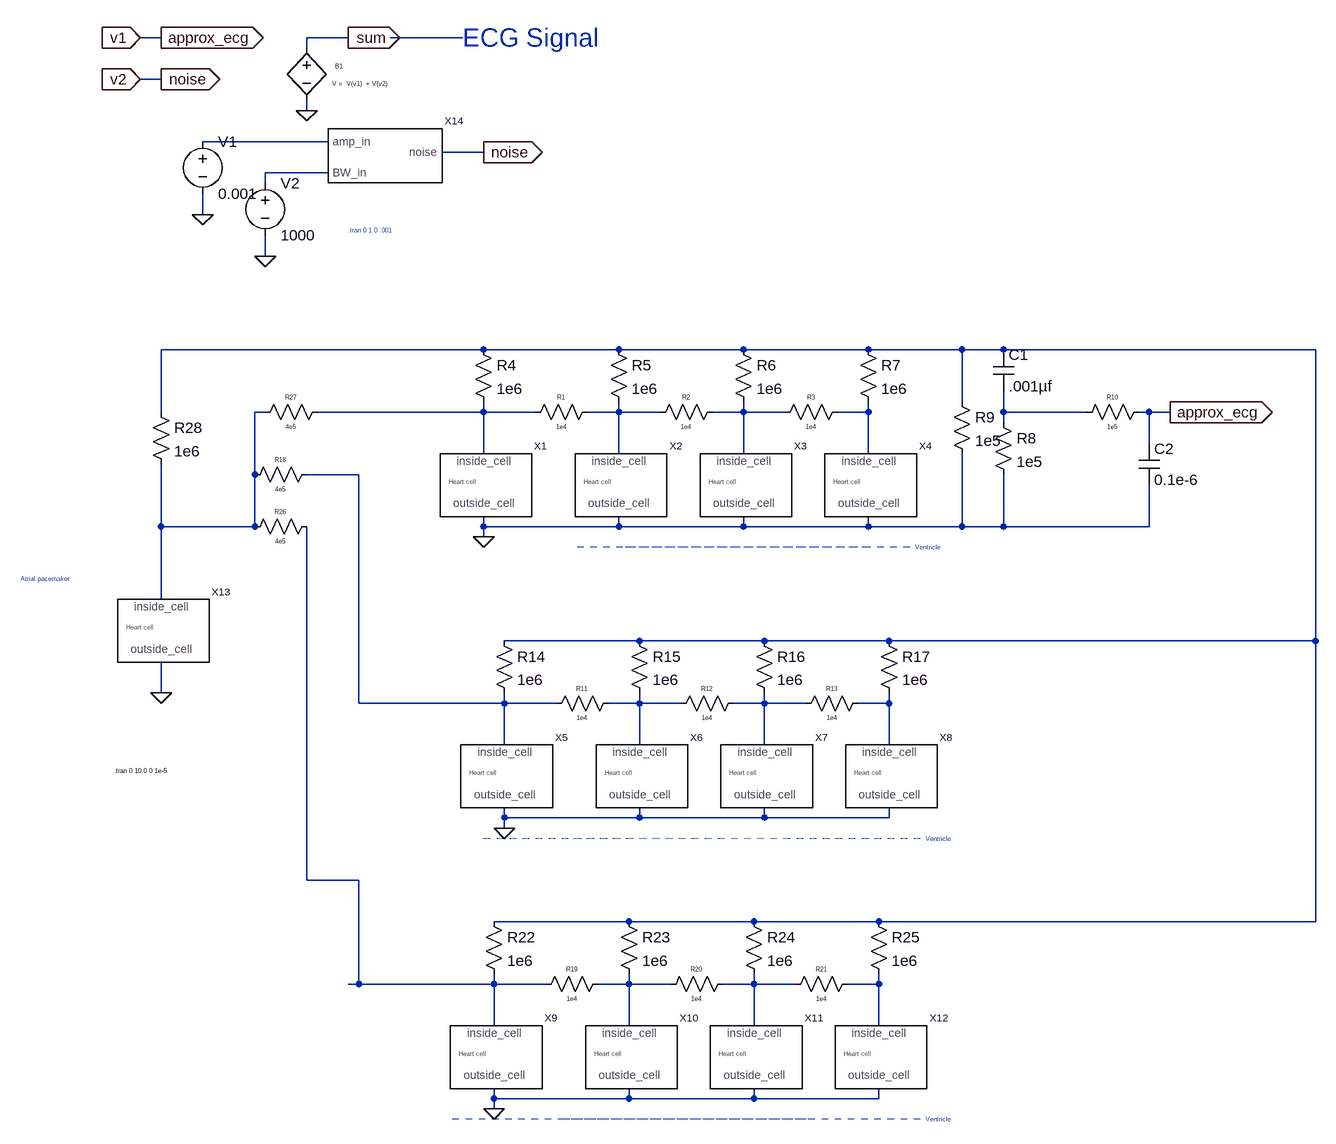
[diagram p0: schematic ECG with noise.asc]
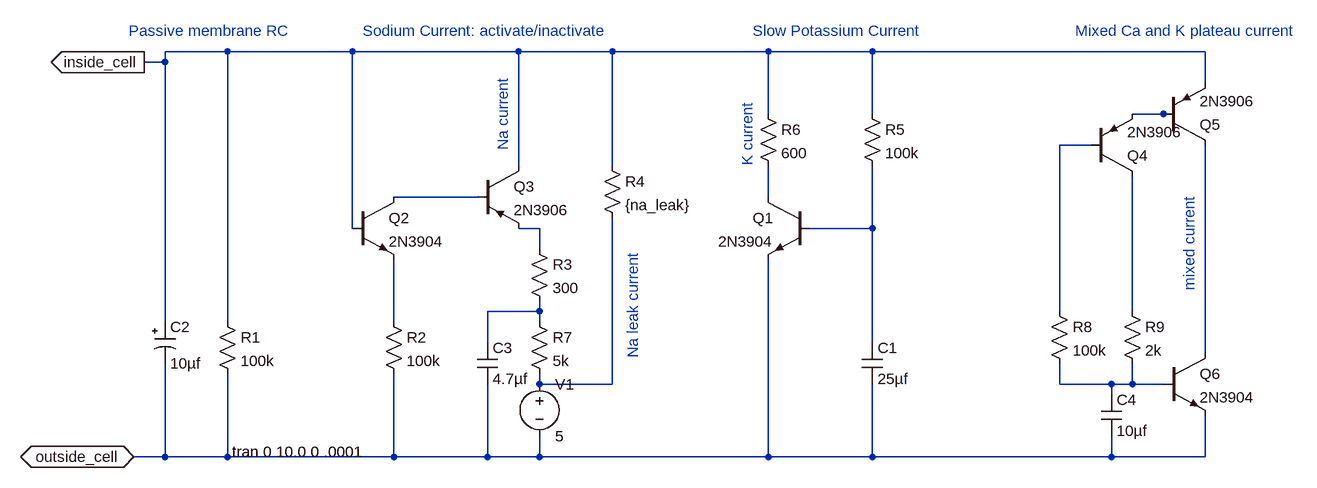
[diagram p1: sub-circuit heart_cell_module.asc]
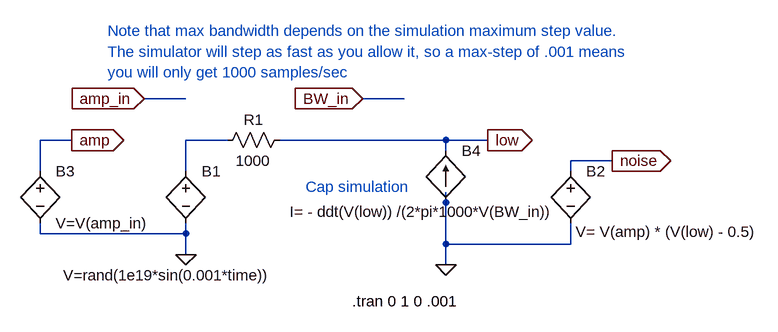
[diagram p2: sub-circuit noise_module.asc]
ECG with noise.asc, the LTspice schematic file:
Version 4.1
SHEET 1 1544 1184
WIRE -272 -512 -304 -512
WIRE 16 -512 -48 -512
WIRE 192 -512 80 -512
WIRE -48 -496 -48 -512
WIRE -272 -448 -304 -448
WIRE -48 -400 -48 -416
WIRE -16 -352 -208 -352
WIRE 224 -336 160 -336
WIRE -16 -304 -112 -304
WIRE -112 -288 -112 -304
WIRE -208 -240 -208 -272
WIRE -112 -176 -112 -208
WIRE 224 -32 -272 -32
WIRE 432 -32 224 -32
WIRE 624 -32 432 -32
WIRE 816 -32 624 -32
WIRE 960 -32 816 -32
WIRE 1024 -32 960 -32
WIRE 1504 -32 1024 -32
WIRE 960 48 960 -32
WIRE -272 64 -272 -32
WIRE -112 64 -128 64
WIRE 224 64 224 48
WIRE 224 64 -32 64
WIRE 304 64 224 64
WIRE 432 64 432 48
WIRE 432 64 384 64
WIRE 496 64 432 64
WIRE 624 64 624 48
WIRE 624 64 576 64
WIRE 688 64 624 64
WIRE 816 64 816 48
WIRE 816 64 768 64
WIRE 1024 64 1024 32
WIRE 1152 64 1024 64
WIRE 1248 64 1232 64
WIRE 1280 64 1248 64
WIRE 1024 80 1024 64
WIRE 1248 112 1248 64
WIRE 224 128 224 64
WIRE 432 128 432 64
WIRE 624 128 624 64
WIRE 816 128 816 64
WIRE -128 160 -128 64
WIRE 32 160 -48 160
WIRE -272 240 -272 144
WIRE -128 240 -128 160
WIRE -128 240 -272 240
WIRE 224 240 224 224
WIRE 432 240 432 224
WIRE 432 240 224 240
WIRE 624 240 624 224
WIRE 624 240 432 240
WIRE 816 240 816 224
WIRE 816 240 624 240
WIRE 960 240 960 128
WIRE 960 240 816 240
WIRE 1024 240 1024 160
WIRE 1024 240 960 240
WIRE 1248 240 1248 176
WIRE 1248 240 1024 240
WIRE 224 256 224 240
WIRE -272 352 -272 240
WIRE 464 416 256 416
WIRE 656 416 464 416
WIRE 848 416 656 416
WIRE 1504 416 1504 -32
WIRE 1504 416 848 416
WIRE -272 496 -272 448
WIRE 32 512 32 160
WIRE 256 512 256 496
WIRE 256 512 32 512
WIRE 336 512 256 512
WIRE 464 512 464 496
WIRE 464 512 416 512
WIRE 528 512 464 512
WIRE 656 512 656 496
WIRE 656 512 608 512
WIRE 720 512 656 512
WIRE 848 512 848 496
WIRE 848 512 800 512
WIRE 256 576 256 512
WIRE 464 576 464 512
WIRE 656 576 656 512
WIRE 848 576 848 512
WIRE 256 688 256 672
WIRE 464 688 464 672
WIRE 464 688 256 688
WIRE 656 688 656 672
WIRE 656 688 464 688
WIRE 848 688 848 672
WIRE 848 688 656 688
WIRE 256 704 256 688
WIRE -48 784 -48 240
WIRE 32 784 -48 784
WIRE 448 848 240 848
WIRE 640 848 448 848
WIRE 832 848 640 848
WIRE 1504 848 1504 416
WIRE 1504 848 832 848
WIRE 32 944 32 784
WIRE 32 944 16 944
WIRE 240 944 240 928
WIRE 240 944 32 944
WIRE 320 944 240 944
WIRE 448 944 448 928
WIRE 448 944 400 944
WIRE 512 944 448 944
WIRE 640 944 640 928
WIRE 640 944 592 944
WIRE 704 944 640 944
WIRE 832 944 832 928
WIRE 832 944 784 944
WIRE 240 1008 240 944
WIRE 448 1008 448 944
WIRE 640 1008 640 944
WIRE 832 1008 832 944
WIRE 240 1120 240 1104
WIRE 448 1120 448 1104
WIRE 448 1120 240 1120
WIRE 640 1120 640 1104
WIRE 640 1120 448 1120
WIRE 832 1120 832 1104
WIRE 832 1120 640 1120
WIRE 240 1136 240 1120
FLAG 224 256 0
FLAG 1280 64 approx_ecg
IOPIN 1280 64 Out
FLAG 256 704 0
FLAG 240 1136 0
FLAG -272 496 0
FLAG -208 -240 0
FLAG -112 -176 0
FLAG -304 -512 v1
IOPIN -304 -512 In
FLAG -304 -448 v2
IOPIN -304 -448 In
FLAG -48 -400 0
FLAG 16 -512 sum
IOPIN 16 -512 Out
FLAG -272 -512 approx_ecg
IOPIN -272 -512 Out
FLAG 224 -336 noise
IOPIN 224 -336 Out
FLAG -272 -448 noise
IOPIN -272 -448 Out
SYMBOL heart_cell_module 224 176 R0
SYMATTR InstName X1
SYMATTR SpiceLine na_leak=500k
SYMBOL heart_cell_module 432 176 R0
SYMATTR InstName X2
SYMATTR SpiceLine na_leak=500k
SYMBOL res 400 48 R90
WINDOW 0 0 56 VBottom 0
WINDOW 3 32 56 VTop 0
SYMATTR InstName R1
SYMATTR Value 1e4
SYMBOL heart_cell_module 624 176 R0
SYMATTR InstName X3
SYMATTR SpiceLine na_leak=500k
SYMBOL heart_cell_module 816 176 R0
SYMATTR InstName X4
SYMATTR SpiceLine na_leak=500k
SYMBOL res 592 48 R90
WINDOW 0 0 56 VBottom 0
WINDOW 3 32 56 VTop 0
SYMATTR InstName R2
SYMATTR Value 1e4
SYMBOL res 784 48 R90
WINDOW 0 0 56 VBottom 0
WINDOW 3 32 56 VTop 0
SYMATTR InstName R3
SYMATTR Value 1e4
SYMBOL res 208 -48 R0
SYMATTR InstName R4
SYMATTR Value 1e6
SYMBOL res 416 -48 R0
SYMATTR InstName R5
SYMATTR Value 1e6
SYMBOL res 608 -48 R0
SYMATTR InstName R6
SYMATTR Value 1e6
SYMBOL res 800 -48 R0
SYMATTR InstName R7
SYMATTR Value 1e6
SYMBOL res 1008 64 R0
SYMATTR InstName R8
SYMATTR Value 1e5
SYMBOL cap 1008 -32 R0
SYMATTR InstName C1
SYMATTR Value .001µf
SYMBOL res 944 32 R0
SYMATTR InstName R9
SYMATTR Value 1e5
SYMBOL res 1248 48 R90
WINDOW 0 0 56 VBottom 0
WINDOW 3 32 56 VTop 0
SYMATTR InstName R10
SYMATTR Value 1e5
SYMBOL cap 1232 112 R0
SYMATTR InstName C2
SYMATTR Value 0.1e-6
SYMBOL heart_cell_module 256 624 R0
SYMATTR InstName X5
SYMATTR SpiceLine na_leak=500k
SYMBOL heart_cell_module 464 624 R0
SYMATTR InstName X6
SYMATTR SpiceLine na_leak=500k
SYMBOL res 432 496 R90
WINDOW 0 0 56 VBottom 0
WINDOW 3 32 56 VTop 0
SYMATTR InstName R11
SYMATTR Value 1e4
SYMBOL heart_cell_module 656 624 R0
SYMATTR InstName X7
SYMATTR SpiceLine na_leak=500k
SYMBOL heart_cell_module 848 624 R0
SYMATTR InstName X8
SYMATTR SpiceLine na_leak=500k
SYMBOL res 624 496 R90
WINDOW 0 0 56 VBottom 0
WINDOW 3 32 56 VTop 0
SYMATTR InstName R12
SYMATTR Value 1e4
SYMBOL res 816 496 R90
WINDOW 0 0 56 VBottom 0
WINDOW 3 32 56 VTop 0
SYMATTR InstName R13
SYMATTR Value 1e4
SYMBOL res 240 400 R0
SYMATTR InstName R14
SYMATTR Value 1e6
SYMBOL res 448 400 R0
SYMATTR InstName R15
SYMATTR Value 1e6
SYMBOL res 640 400 R0
SYMATTR InstName R16
SYMATTR Value 1e6
SYMBOL res 832 400 R0
SYMATTR InstName R17
SYMATTR Value 1e6
SYMBOL res -32 144 R90
WINDOW 0 0 56 VBottom 0
WINDOW 3 32 56 VTop 0
SYMATTR InstName R18
SYMATTR Value 4e5
SYMBOL heart_cell_module 240 1056 R0
SYMATTR InstName X9
SYMATTR SpiceLine na_leak=500k
SYMBOL heart_cell_module 448 1056 R0
SYMATTR InstName X10
SYMATTR SpiceLine na_leak=500k
SYMBOL res 416 928 R90
WINDOW 0 0 56 VBottom 0
WINDOW 3 32 56 VTop 0
SYMATTR InstName R19
SYMATTR Value 1e4
SYMBOL heart_cell_module 640 1056 R0
SYMATTR InstName X11
SYMATTR SpiceLine na_leak=500k
SYMBOL heart_cell_module 832 1056 R0
SYMATTR InstName X12
SYMATTR SpiceLine na_leak=500k
SYMBOL res 608 928 R90
WINDOW 0 0 56 VBottom 0
WINDOW 3 32 56 VTop 0
SYMATTR InstName R20
SYMATTR Value 1e4
SYMBOL res 800 928 R90
WINDOW 0 0 56 VBottom 0
WINDOW 3 32 56 VTop 0
SYMATTR InstName R21
SYMATTR Value 1e4
SYMBOL res 224 832 R0
SYMATTR InstName R22
SYMATTR Value 1e6
SYMBOL res 432 832 R0
SYMATTR InstName R23
SYMATTR Value 1e6
SYMBOL res 624 832 R0
SYMATTR InstName R24
SYMATTR Value 1e6
SYMBOL res 816 832 R0
SYMATTR InstName R25
SYMATTR Value 1e6
SYMBOL res -32 224 R90
WINDOW 0 0 56 VBottom 0
WINDOW 3 32 56 VTop 0
SYMATTR InstName R26
SYMATTR Value 4e5
SYMBOL heart_cell_module -272 400 R0
SYMATTR InstName X13
SYMATTR SpiceLine na_leak=400k
SYMBOL res -16 48 R90
WINDOW 0 0 56 VBottom 0
WINDOW 3 32 56 VTop 0
SYMATTR InstName R27
SYMATTR Value 4e5
SYMBOL res -288 48 R0
SYMATTR InstName R28
SYMATTR Value 1e6
SYMBOL noise_module 112 -336 R0
SYMATTR InstName X14
SYMBOL voltage -208 -368 R0
WINDOW 123 0 0 Left 0
WINDOW 39 0 0 Left 0
SYMATTR InstName V1
SYMATTR Value 0.001
SYMBOL voltage -112 -304 R0
WINDOW 123 0 0 Left 0
WINDOW 39 0 0 Left 0
SYMATTR InstName V2
SYMATTR Value 1000
SYMBOL bv -48 -512 R0
WINDOW 0 44 44 Left 0
WINDOW 3 39 71 Left 0
SYMATTR InstName B1
SYMATTR Value V =  V(v1)  + V(v2)
TEXT -344 616 Left 0 !.tran 0 10.0 0 1e-5
TEXT 888 272 Left 0 ;Ventricle
TEXT -488 320 Left 0 ;Atrial pacemaker
TEXT 904 720 Left 0 ;Ventricle
TEXT 904 1152 Left 0 ;Ventricle
TEXT 16 -216 Left 0 ;.tran 0 1 0 .001
TEXT 192 -512 Left 4 ;ECG Signal
LINE Normal 816 272 432 272 1
LINE Normal 736 720 352 720 1
LINE Normal 720 1152 336 1152 1
LINE Normal 880 272 368 272 1
LINE Normal 896 720 224 720 1
LINE Normal 896 1152 176 1152 1

heart_cell_module.asc, the sub-circuit schematic file:
Version 4.1
SHEET 1 2184 696
WIRE 176 0 80 0
WIRE 368 0 176 0
WIRE 624 0 368 0
WIRE 768 0 624 0
WIRE 1008 0 768 0
WIRE 1168 0 1008 0
WIRE 1680 0 1168 0
WIRE 80 16 80 0
WIRE 80 16 48 16
WIRE 1680 48 1680 0
WIRE 1008 96 1008 0
WIRE 1168 96 1168 0
WIRE 1616 96 1568 96
WIRE 1632 96 1616 96
WIRE 1504 144 1456 144
WIRE 624 176 624 0
WIRE 768 176 768 0
WIRE 560 224 432 224
WIRE 1008 224 1008 176
WIRE 368 272 368 0
WIRE 656 272 624 272
WIRE 1168 272 1168 176
WIRE 1168 272 1072 272
WIRE 656 304 656 272
WIRE 656 400 656 384
WIRE 656 400 576 400
WIRE 1456 400 1456 144
WIRE 1568 400 1568 192
WIRE 80 416 80 16
WIRE 176 416 176 0
WIRE 432 416 432 320
WIRE 656 416 656 400
WIRE 576 448 576 400
WIRE 1168 448 1168 272
WIRE 1680 464 1680 144
WIRE 656 512 656 496
WIRE 768 512 768 256
WIRE 768 512 656 512
WIRE 1456 512 1456 480
WIRE 1536 512 1456 512
WIRE 1568 512 1568 480
WIRE 1568 512 1536 512
WIRE 1616 512 1568 512
WIRE 1536 528 1536 512
WIRE 80 624 80 480
WIRE 80 624 32 624
WIRE 176 624 176 496
WIRE 176 624 80 624
WIRE 432 624 432 496
WIRE 432 624 176 624
WIRE 576 624 576 512
WIRE 576 624 432 624
WIRE 656 624 656 592
WIRE 656 624 576 624
WIRE 1008 624 1008 320
WIRE 1008 624 656 624
WIRE 1168 624 1168 512
WIRE 1168 624 1008 624
WIRE 1536 624 1536 592
WIRE 1536 624 1168 624
WIRE 1680 624 1680 560
WIRE 1680 624 1536 624
FLAG 48 16 inside_cell
IOPIN 48 16 Out
FLAG 32 624 outside_cell
IOPIN 32 624 BiDir
SYMBOL npn 1072 224 M0
SYMATTR InstName Q1
SYMATTR Value 2N3904
SYMBOL npn 368 224 R0
SYMATTR InstName Q2
SYMATTR Value 2N3904
SYMBOL pnp2 560 176 R0
SYMATTR InstName Q3
SYMATTR Value 2N3906
SYMBOL cap 1152 448 R0
SYMATTR InstName C1
SYMATTR Value 25µf
SYMATTR SpiceLine V=10 Irms=0 Rser=0.009 Lser=0
SYMBOL polcap 64 416 R0
WINDOW 3 24 64 Left 0
SYMATTR Value 10µf
SYMATTR InstName C2
SYMATTR Description Capacitor
SYMATTR Type cap
SYMATTR SpiceLine V=50 Irms=22m Rser=3.9 Lser=0
SYMBOL res 160 400 R0
SYMATTR InstName R1
SYMATTR Value 100k
SYMBOL res 416 400 R0
SYMATTR InstName R2
SYMATTR Value 100k
SYMBOL res 640 288 R0
SYMATTR InstName R3
SYMATTR Value 300
SYMBOL voltage 656 496 R0
WINDOW 123 0 0 Left 0
WINDOW 39 0 0 Left 0
SYMATTR InstName V1
SYMATTR Value 5
SYMBOL res 752 160 R0
SYMATTR InstName R4
SYMATTR Value {na_leak}
SYMBOL res 1152 80 R0
SYMATTR InstName R5
SYMATTR Value 100k
SYMBOL res 992 80 R0
SYMATTR InstName R6
SYMATTR Value 600
SYMBOL res 640 400 R0
SYMATTR InstName R7
SYMATTR Value 5k
SYMBOL cap 560 448 R0
SYMATTR InstName C3
SYMATTR Value 4.7µf
SYMBOL npn 1616 464 R0
SYMATTR InstName Q6
SYMATTR Value 2N3904
SYMBOL cap 1520 528 R0
SYMATTR InstName C4
SYMATTR Value 10µf
SYMBOL res 1440 384 R0
SYMATTR InstName R8
SYMATTR Value 100k
SYMBOL res 1552 384 R0
SYMATTR InstName R9
SYMATTR Value 2k
SYMBOL pnp 1504 192 M180
SYMATTR InstName Q4
SYMATTR Value 2N3906
SYMBOL pnp 1616 144 M180
SYMATTR InstName Q5
SYMATTR Value 2N3906
TEXT 176 616 Left 0 !.tran 0 10.0 0 .0001
TEXT 384 -32 Left 0 ;Sodium Current: activate/inactivate
TEXT 984 -32 Left 0 ;Slow Potassium Current
TEXT 24 -32 Left 0 ;Passive membrane RC
TEXT 1480 -32 Left 0 ;Mixed Ca and K plateau current
TEXT 976 176 VLeft 0 ;K current
TEXT 600 152 VLeft 0 ;Na current
TEXT 1656 368 VLeft 0 ;mixed current
TEXT 800 472 VLeft 0 ;Na leak current

noise_module.asc, the sub-circuit schematic file:
Version 4
SHEET 1 940 680
WIRE -112 0 -176 0
WIRE 224 0 160 0
WIRE -288 64 -336 64
WIRE -48 64 -112 64
WIRE 288 64 32 64
WIRE 352 64 288 64
WIRE 288 80 288 64
WIRE 544 96 480 96
WIRE -336 112 -336 64
WIRE -112 112 -112 64
WIRE 480 112 480 96
WIRE 288 160 288 144
WIRE -336 208 -336 192
WIRE -112 208 -112 192
WIRE -112 208 -336 208
WIRE 288 224 288 160
WIRE 480 224 480 192
WIRE 480 224 288 224
WIRE -112 240 -112 208
WIRE 288 256 288 224
FLAG -112 240 0
FLAG 288 256 0
FLAG 352 64 low
IOPIN 352 64 Out
FLAG 544 96 noise
IOPIN 544 96 Out
FLAG -288 64 amp
IOPIN -288 64 Out
FLAG -176 0 amp_in
IOPIN -176 0 In
FLAG 160 0 BW_in
IOPIN 160 0 In
SYMBOL bv -112 96 R0
WINDOW 3 -189 176 Left 0
SYMATTR Value V=rand(1e19*sin(0.001*time))
SYMATTR InstName B1
SYMBOL res 48 48 R90
WINDOW 0 0 56 VBottom 0
WINDOW 3 32 56 VTop 0
SYMATTR InstName R1
SYMATTR Value 1000
SYMBOL bv 480 96 R0
WINDOW 3 8 109 Left 0
SYMATTR Value V= V(amp) * (V(low) - 0.5)
SYMATTR InstName B2
SYMBOL bv -336 96 R0
SYMATTR InstName B3
SYMATTR Value V=V(amp_in)
SYMBOL bi2 288 80 R0
WINDOW 3 -240 94 Left 0
SYMATTR InstName B4
SYMATTR Value I= - ddt(V(low)) /(2*pi*1000*V(BW_in))
TEXT 144 312 Left 0 !.tran 0 1 0 .001
TEXT 72 136 Left 0 ;Cap simulation
TEXT -232 -104 Left 0 ;Note that max bandwidth depends on the simulation maximum step value.
TEXT -232 -72 Left 0 ;The simulator will step as fast as you allow it, so a max-step of .001 means\nyou will only get 1000 samples/sec

The netlist it stands for:
* ECG with noise.asc
X§X1 0 N006 heart_cell_module params: na_leak=500k
X§X2 0 N007 heart_cell_module params: na_leak=500k
R1 N007 N006 1e4
X§X3 0 N008 heart_cell_module params: na_leak=500k
X§X4 0 N009 heart_cell_module params: na_leak=500k
R2 N008 N007 1e4
R3 N009 N008 1e4
R4 N004 N006 1e6
R5 N004 N007 1e6
R6 N004 N008 1e6
R7 N004 N009 1e6
R8 N010 0 1e5
C1 N004 N010 .001µf
R9 N004 0 1e5
R10 v1 N010 1e5
C2 v1 0 0.1e-6
X§X5 0 N011 heart_cell_module params: na_leak=500k
X§X6 0 N012 heart_cell_module params: na_leak=500k
R11 N012 N011 1e4
X§X7 0 N013 heart_cell_module params: na_leak=500k
X§X8 0 N014 heart_cell_module params: na_leak=500k
R12 N013 N012 1e4
R13 N014 N013 1e4
R14 N004 N011 1e6
R15 N004 N012 1e6
R16 N004 N013 1e6
R17 N004 N014 1e6
R18 N011 N005 4e5
X§X9 0 N015 heart_cell_module params: na_leak=500k
X§X10 0 N016 heart_cell_module params: na_leak=500k
R19 N016 N015 1e4
X§X11 0 N017 heart_cell_module params: na_leak=500k
X§X12 0 N018 heart_cell_module params: na_leak=500k
R20 N017 N016 1e4
R21 N018 N017 1e4
R22 N004 N015 1e6
R23 N004 N016 1e6
R24 N004 N017 1e6
R25 N004 N018 1e6
R26 N015 N005 4e5
X§X13 0 N005 heart_cell_module params: na_leak=400k
R27 N006 N005 4e5
R28 N004 N005 1e6
X§X14 N002 N003 noise noise_module
V1 N002 0 0.001
V2 N003 0 1000
B1 sum 0 V =  V(v1)  + V(v2)

* block symbol definitions
.subckt heart_cell_module outside_cell inside_cell
Q1 N004 N006 outside_cell 0 2N3904
Q2 N003 inside_cell N009 0 2N3904
Q3 inside_cell N003 N005 0 2N3906
C1 N006 outside_cell 25µf V=10 Irms=0 Rser=0.009 Lser=0
C2 inside_cell outside_cell 10µf V=50 Irms=22m Rser=3.9 Lser=0
R1 inside_cell outside_cell 100k
R2 N009 outside_cell 100k
R3 N005 N007 300
V1 N011 outside_cell 5
R4 inside_cell N011 {na_leak}
R5 inside_cell N006 100k
R6 inside_cell N004 600
R7 N007 N011 5k
C3 N007 outside_cell 4.7µf
Q6 N010 N012 outside_cell 0 2N3904
C4 N012 outside_cell 10µf
R8 N002 N012 100k
R9 N008 N012 2k
Q4 N008 N002 N001 0 2N3906
Q5 N010 N001 inside_cell 0 2N3906
.tran 0 10.0 0 .0001
* Sodium Current: activate/inactivate
* Slow Potassium Current
* Passive membrane RC
* Mixed Ca and K plateau current
* K current
* Na current
* mixed current
* Na leak current
.ends heart_cell_module

.subckt noise_module amp_in BW_in noise
B1 N001 0 V=rand(1e19*sin(0.001*time))
R1 low N001 1000
B2 noise 0 V= V(amp) * (V(low) - 0.5)
B3 amp 0 V=V(amp_in)
B4 0 low I= - ddt(V(low)) /(2*pi*1000*V(BW_in))
.tran 0 1 0 .001
* Cap simulation
* Note that max bandwidth depends on the simulation maximum step value.
* The simulator will step as fast as you allow it, so a max-step of .001 means
* you will only get 1000 samples/sec
.ends noise_module

.model NPN NPN
.model PNP PNP
.lib standard.bjt
.tran 0 10.0 0 1e-5
* Ventricle
* Atrial pacemaker
* Ventricle
* Ventricle
* .tran 0 1 0 .001
* ECG Signal
.backanno
.end